# EAGLE schematic PWM Connector (EAGLE 8.3.2)
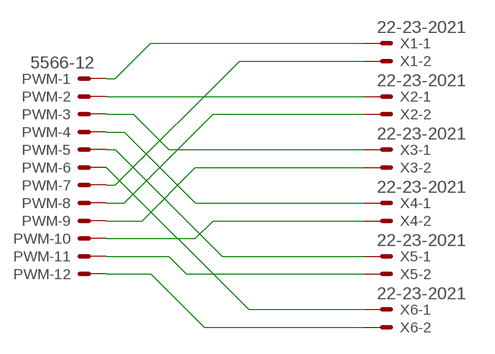
[diagram p0: schematic, sheet 1]

## Parts
PWM  5566-12  [5566-12]
X1  22-23-2021  [22-23-2021]
X2  22-23-2021  [22-23-2021]
X3  22-23-2021  [22-23-2021]
X4  22-23-2021  [22-23-2021]
X5  22-23-2021  [22-23-2021]
X6  22-23-2021  [22-23-2021]

## Nets
N$1: PWM.1 X1.1
N$2: PWM.2 X2.1
N$3: PWM.3 X3.1
N$4: PWM.4 X4.1
N$5: PWM.5 X5.1
N$6: PWM.6 X6.1
N$7: PWM.7 X1.2
N$8: PWM.8 X2.2
N$9: PWM.9 X3.2
N$10: PWM.10 X4.2
N$11: PWM.11 X5.2
N$12: PWM.12 X6.2

## Library data of the parts
PWM = con-molex:5566-12: Mini FIT connector 12 pol Source: http://www.molex.com; OC_FARNELL: unknown; OC_NEWARK: unknown
X1-X6 = con-molex:22-23-2021: .100" (2.54mm) Center Header - 2 Pin; MF: MOLEX; MPN: 22-23-2021; OC_FARNELL: 1462926; OC_NEWARK: 25C3832